# EAGLE design UPDIProgrammerStick_LW_Order (EAGLE 7.7.0)
COMPANY: ADAFRUIT INDUSTRIES; DRAWN: KTOWN; REV: H

## Sheet 1 of 2
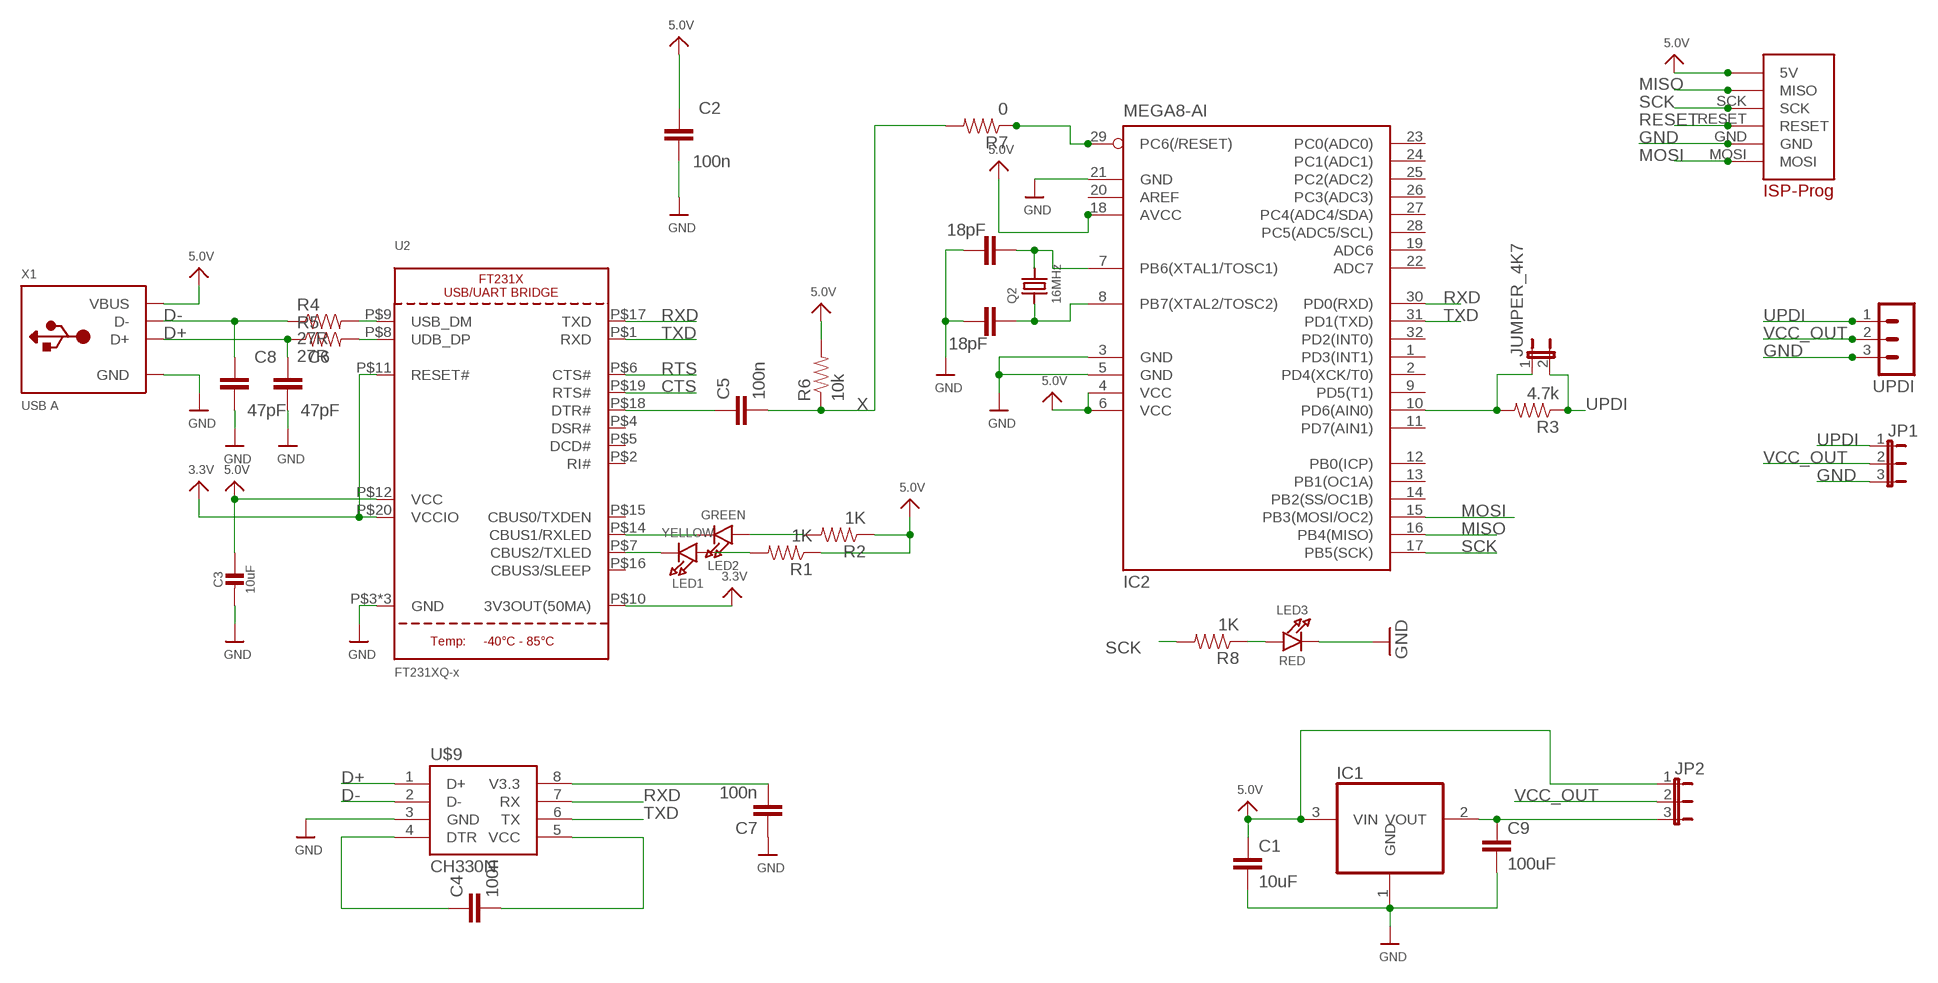
[diagram p0: schematic, sheet 1]

### Parts
C1  10uF  C-EUC1206  [C1206]
C2  100n  CAP0603-CAP  [0603-CAP]
C3  10uF  CAP_CERAMIC_1206  [_1206]
C4  100n  CAP0603-CAP  [0603-CAP]
C5  100n  CAP0603-CAP  [0603-CAP]
C6  47pF  CAP0603-CAP  [0603-CAP]
C7  100n  CAP0603-CAP  [0603-CAP]
C8  47pF  CAP0603-CAP  [0603-CAP]
C9  100uF  C-EUC1206  [C1206]
C12  18pF  CAP0603-CAP  [0603-CAP]
C13  18pF  CAP0603-CAP  [0603-CAP]
IC1  REG1117  [SOT223]
IC2  MEGA8-AI  [TQFP32-08]
JP1  JP2E  [JP2]
JP2  JP2E  [JP2]
JUMPER_4K7  JP1E  [JP1]
LED1  YELLOW  LED0805_NOOUTLINE  [CHIPLED_0805_NOOUTLINE]
LED2  GREEN  LED0805_NOOUTLINE  [CHIPLED_0805_NOOUTLINE]
LED3  RED  LED0805_NOOUTLINE  [CHIPLED_0805_NOOUTLINE]
Q2  16MHz  CRYSTALTHIN  [CRYSTAL_3.2X2.5]
R1  1K  0.3OHM-1/8W-1%(0805)  [0805]
R2  1K  0.3OHM-1/8W-1%(0805)  [0805]
R3  4.7k  0.3OHM-1/8W-1%(0805)  [0805]
R4  27R  0.3OHM-1/8W-1%(0805)  [0805]
R5  27R  0.3OHM-1/8W-1%(0805)  [0805]
R6  10k  0.3OHM-1/8W-1%(0805)  [0805]
R7  0  0.3OHM-1/8W-1%(0805)  [0805]
R8  1K  0.3OHM-1/8W-1%(0805)  [0805]
U2  FT231XQ-x  FT231X  [QFN20_4MM]
U$6  ISP_PROG_STECKERISP_PROG_REIHE_DIP  [ISP_PROG_REIHE_DIP]
U$9  CH330N  [SOIC8]
UPDI  S3B-PH-K-S  [S3B-PH-K-S]
X1  USB A  USB_TYPEA_CLIENTTHM  [USB_A-THM]

### Nets
3.3V: U2.P$10(3V3OUT(50MA)) U2.P$11(RESET#) U2.P$20(VCCIO)
5.0V: C1.1 C2.1 C3.1 IC1.3(VIN) IC2.4(VCC) IC2.6(VCC) IC2.18(AVCC) JP2.1 R1.1 R2.1 R6.2 U2.P$12(VCC) U$6.5V X1.VBUS
CTS: U2.P$19(RTS#)
D+: C6.1 R5.1 U$9.1(D+) X1.D+
D-: C8.1 R4.1 U$9.2(D-) X1.D-
GND: C1.2 C2.2 C3.2 C6.2 C7.1 C8.2 C9.2 C12.2 C13.2 IC1.1(GND) IC2.3(GND) IC2.5(GND) IC2.21(GND) JP1.3 LED3.C U2.P$3(GND) U2.P$13(GND) U2.P$21(GND) U$6.GND U$9.3(GND) UPDI.3 X1.GND
MISO: IC2.16(PB4(MISO)) U$6.MISO
MOSI: IC2.15(PB3(MOSI/OC2)) U$6.MOSI
N$1: LED2.A R2.2
N$2: C12.1 IC2.7(PB6(XTAL1/TOSC1)) Q2.2
N$3: IC2.10(PD6(AIN0)) JUMPER_4K7.1 R3.2
N$4: LED1.A R1.2
N$5: LED1.C U2.P$7(CBUS2/TXLED)
N$6: LED2.C U2.P$14(CBUS1/RXLED)
N$7: C7.2 U$9.8(V3.3)
N$11: C13.1 IC2.8(PB7(XTAL2/TOSC2)) Q2.1
N$12: C9.1 IC1.2(VOUT) JP2.3
N$13: C4.2 U$9.5(VCC)
N$15: R5.2 U2.P$8(UDB_DP)
N$16: LED3.A R8.1
N$20: C4.1 U$9.4(DTR)
N$24: R4.2 U2.P$9(USB_DM)
N$27: C5.1 U2.P$18(DTR#)
RESET: IC2.29(PC6(/RESET)) R7.1 U$6.RESET
RTS: U2.P$6(CTS#)
RXD: IC2.30(PD0(RXD)) U2.P$17(TXD) U$9.7(RX)
SCK: IC2.17(PB5(SCK)) R8.2 U$6.SCK
TXD: IC2.31(PD1(TXD)) U2.P$1(RXD) U$9.6(TX)
UPDI: JP1.1 JUMPER_4K7.2 R3.1 UPDI.1
VCC_OUT: JP1.2 JP2.2 UPDI.2
X: C5.2 R6.1 R7.2
Unconnected: IC2.1(PD3(INT1)) IC2.2(PD4(XCK/T0)) IC2.9(PD5(T1)) IC2.11(PD7(AIN1)) IC2.12(PB0(ICP)) IC2.13(PB1(OC1A)) IC2.14(PB2(SS/OC1B)) IC2.19(ADC6) IC2.20(AREF) IC2.22(ADC7) IC2.23(PC0(ADC0)) IC2.24(PC1(ADC1)) IC2.25(PC2(ADC2)) IC2.26(PC3(ADC3)) IC2.27(PC4(ADC4/SDA)) IC2.28(PC5(ADC5/SCL)) IC2.32(PD2(INT0)) U2.P$2(RI#) U2.P$4(DSR#) U2.P$5(DCD#) U2.P$15(CBUS0/TXDEN) U2.P$16(CBUS3/SLEEP)

## Sheet 2 of 2

## Library data of the parts
C1 C9 = rcl:C-EU: CAPACITOR, European symbol
C2 C4-C8 C12 C13 = SparkFun-Capacitors:CAP: Capacitor Standard 0603 ceramic capacitor, and 0.1" leaded capacitor.
C3 = microbuilder:CAP_CERAMIC: Ceramic Capacitors For new designs, use the packages preceded by an '_' character since they are more reliable: The following footprints should be used on most boards: _0402 - Standard footprint for regular board layouts _0603 - Standard footprint for regular board layouts _0805 - Standard footprint for regular board layouts _1206 - Standard footprint for regular board layouts For extremely tight-pitch boards where space is at a premium, the following 'micro-pitch' footprints can be used (smaller pads, no silkscreen outline, etc.): _0402MP - Micro-pitch footprint for very dense/compact boards _0603MP - Micro-pitch footprint for very dense/compact boards _0805MP - Micro-pitch footprint for very dense/compact boards _1206MP - Micro-pitch footprint for very dense/compact boards
IC1 = burr-brown:REG1117: 800mA and 1A Low Dropout (LDO) Positive Regulator 1.8V, 2.5V, 2.85V, 3.3V, 5V, and Adj; MPN: REG1117; OC_FARNELL: 1097566; OC_NEWARK: 14P6981
IC2 = atmel:MEGA8: MICROCONTROLLER 8 Kbytes FLASH, 1 kbytes SRAM, 512 bytes EEPROM, USART, 6-channel 10 bit ADC, 2-channel 8 bit ADC Pin compatible with Atmega48, ATMega88, ATMega168 Source: avr.lbr; MPN: ATMEGA8-16AU; OC_FARNELL: 9171371; OC_NEWARK: 73M8863
JP1 JP2 = jumper:JP2E: JUMPER
JUMPER_4K7 = jumper:JP1E: JUMPER
LED1-LED3 = microbuilder:LED: LED 0603 - 0603 Surface Mount Package 2mA: Green LED - Low Power (3.9mcd, 2ma, 1.7Vf) - Digikey: 475-2709-2-ND Orange LED - Low Power (9.8mcd, 2ma, 1.8Vf) - Digikey: 475-1194-2-ND Red LED - Low Power (5mcd, 2ma, 1.8Vf) - Digikey: 475-1195-2-ND Yellow LED - Low Power (7mcd, 2ma, 1.8Vf) - Digikey: 475-1196-2-ND 5mA: Blue LED - Low Power (17mcd, 5ma, 2.9Vf) - Digikey: LNJ937W8CRACT-ND 0805 - 0805 Surface Mount Package 2mA: Red LED (8.8mcd, 2mA, 1.8Vf, Clear) - Low Power [Digikey: 475-2510-1-ND] Green LED (5mcd, 2mA, 1.8Vf, Clear) - Low Power [Digikey: 475-2730-1-ND] Yellow LED (11.3mcd, 2mA, 1.8Vf, Clear) - Low Power [Digikey: 475-2555-1-ND] 20mA: Red LED (104mcd, 20mA, Diffused) - LS R976 [Digikey: 475-1278-6-ND] Red LED (12mcd, 20mA, 2.0Vf, Clear) - APT2012EC [Digikey: 754-1128-1-ND] Green LED (15mcd, 20mA, 2.2Vf, Clear) - APT2012GC [Digikey: 754-1131-1-ND] Orange LED (160mcd, 20mA, 2.1Vf, Clear) - APT2012SECK [Digikey: 754-1130-1-ND] 1206 - 1206 Surface Mount Package Green LED (26mcd, 20mA, Diffused) - LG N971 [Digikey: 475-1407-6-ND] Red LED (15mcd, 20mA, Diffused) - LH N974 [Digikey: 475-1416-6-ND] Cree - Cree High-Power Surface Mount LEDs XPEBWT-L1-0000-00D50 - White 111lm 350mA 2.9Vf 6200K 110° XTEAWT-00-0000-00000LEE3 - White 114lm 350mA 2.85Vf 5000K 115° Everlight - Everlight 45-21 Series Surface Mount LEDs 45-21/QK2C-B2832AC2CB2/2T - Warm White 2000mcd 20mA 3.25Vf 3050K 120° 45-21/LK2C-B38452C4CB2/2T - Nuetral White 2000mcd 20mA 3.25Vf 4150K 120° 45-21/LK2C-B50634C6CB2/2T - Cold White 2200mcd 20mA 3.25Vf 5650K 120° PLCC2 Reverse Mount LS T77K-J1L2-1-0-2-R18-Z - Red 11.25mcd 2mA 1.8Vf 630nm 120° LO T77K-L1M2-24-Z - Orange 19.6mcd 2mA 1.8Vf 606nm 120° LY T77K-K2M1-26-Z - Yellow 15.7mcd 2mA 1.8Vf 587nm 120°
Q2 = microbuilder:CRYSTAL: Crystals HC49UP - Surface Mount Crystal 4.0MHz 18pF +/-30ppm Surface Mount Crystal [Digikey: 535-9857-1-ND] 12.0 MHz Surface Mount Crystal [Digikey: 535-9869-6-ND] 25.0 MHz Surface Mount Crystal [Digikey: 535-9078-1-ND] 2.5 x 2.0mm - MEMs SMT Crystal 16.0 MHz 10pF 20ppm 2.5 x 2.0mm Crystal [Digikey -40-85°C: 535-10923-1-ND] 3.2 x 2.5mm - MEMs SMT Crystal 12.0 MHz 8pF 15ppm 3.2 x 2.5mm Crystal [Digikey: -10-70°C: 644-1047-1-ND -40-125°C: 644-1128-1-ND] 16.0 MHz 8pF 15ppm 3.2 x 2.5mm Crystal [Digikey: -10-70°C: 644-1049-1-ND -40-125°C: 644-1129-2-ND] 16.0 MHz 10pF 10ppm 3.2 x 2.5mm Crystal [Digikey: 644-1100-1-ND] 27.12 MHz 18pF 30ppm 3.2 x 2.5mm Crystal [Digikey: 887-1424-1-ND] 27.12MHz 10pF 10ppm 3.2 x 2.5mm Crystal [Digikey: 887-1329-1-ND] 4.9 x 1.8mm - MEMs SMT Crystal 32.768 KHz 12.5pF 20ppm 4.9 x 1.8mm Crystal [Digikey: SE2415CT-ND] 8.0 x 3.8mm - Surface Mount Crystal 32.768kHz 12.5pF 20ppm -40°C-85°C [Digikey: 535-9166-2-ND] Cylinder 32.768KHz Cylinder Crystal (2x6mm body) [Ex. Digikey: 300-8341-2-ND]
R1-R8 = SparkFun-Resistors:0.3OHM-1/8W-1%(0805): RES-11622; PROD_ID: RES-11622; VALUE: 0.3
U2 = microbuilder:FT231X: FT231X USB To Full Handshake UART IC
U$6 = RUAG_el_LW:ISP_PROG_STECKER
U$9 = ch330n:CH330N
UPDI = con-JST:S3B-PH: JST PH series header 2.00mm pitch disconnectable crimp style connectors, horizontal (side entry type), 3 pins
X1 = microbuilder:USB_TYPEA: USB - Type A Connectors Male types stick out and are inserted into a PC or matching females parts (these are the connectors used on USB Memory Sticks, etc.). Female parts are generally used for USB Host and accept a male-type connector. SMT - 4UCON: 10017 PTHFML - Digikey: 609-1045-ND, 4UCon: 05241 PCB - Use 2.0mm thick PCBs with this footprint

## Board
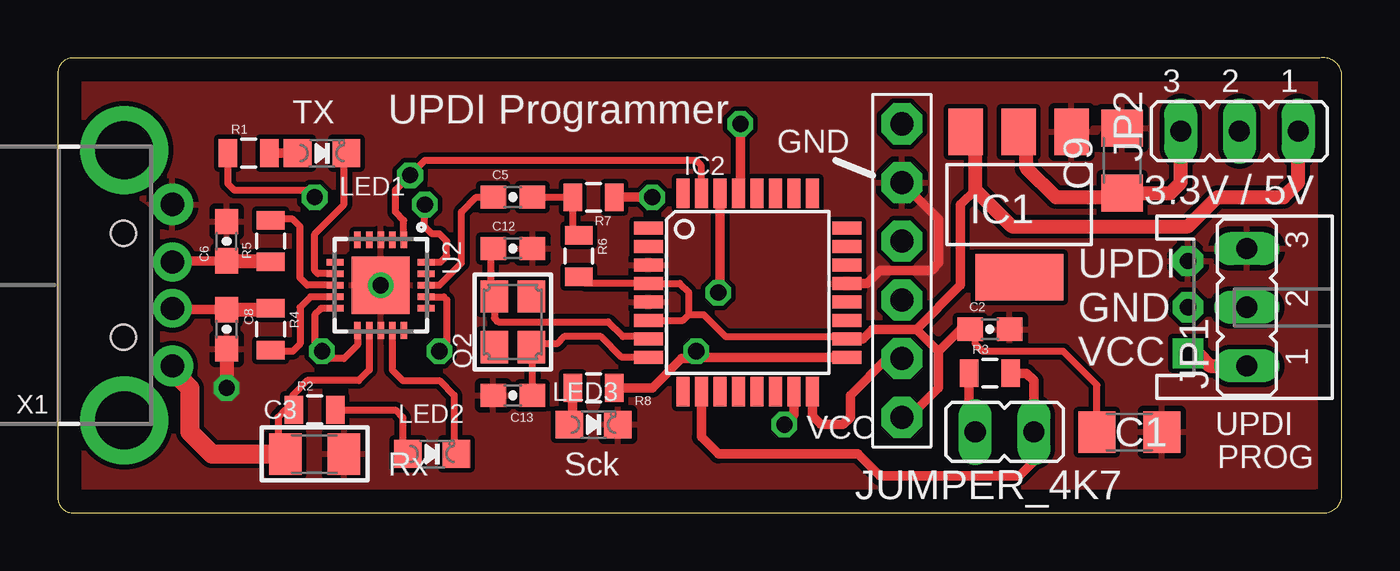
[diagram p1: board, top side]
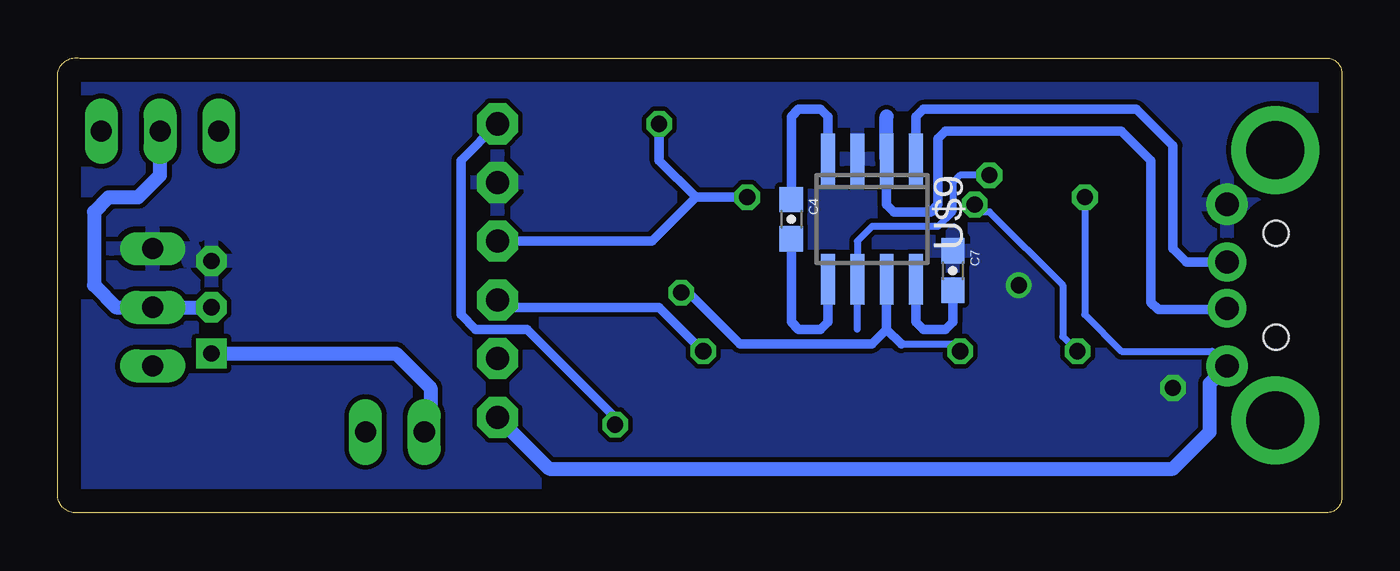
[diagram p2: board, bottom side, seen from below]

Size 55.54 x 19.7 mm. Coordinates in mm from the lower left corner, seen from the top.
Outline: 0,19.05 0,0.65 arc90 0.63,0.02 54.59,0.02 arc90 55.54,0.65 55.54,19.05 arc90 54.59,19.69 0.63,19.69 arc90 0,19.05
Copper layers (1*16): Top 0.035mm / dielectric 1.5mm / Bottom 0.035mm
Design rules "default": minimum track width 10mil, minimum drill 24mil, track to track 8mil, track to pad 8mil, pad to pad 8mil, via to via 8mil, smd to smd 8mil, copper to edge 40mil, drill to drill 8mil, minimum pad ring 10mil, minimum via ring 8mil, stop-mask expansion 4mil, vias tented up to drill 0mil, thermal gap 10mil

### Footprints (pad centres in the part's own frame; a part is rotated, then mirrored left to right if it is on the bottom)
C1206 = smd 1.6 x 1.8: 1 -1.4,0; 2 1.4,0
0603-CAP = smd 1.1 x 1: 1 -0.85,0; 2 0.85,0
_1206 = smd 1.4 x 1.8: 1 -1.27,0; 2 1.27,0
SOT223 = smd 1.499 x 2.007: 1 -2.261,-3.15; 2 0.025,-3.15; 3 2.311,-3.15 | smd 3.81 x 2.007: 4 0,3.15
TQFP32-08 = smd 1.27 x 0.559: 1 -4.293,2.8; 2 -4.293,2; 3 -4.293,1.2; 4 -4.293,0.4; 5 -4.293,-0.4; 6 -4.293,-1.2; 7 -4.293,-2; 8 -4.293,-2.8; 17 4.293,-2.8; 18 4.293,-2; 19 4.293,-1.2; 20 4.293,-0.4; 21 4.293,0.4; 22 4.293,1.2; 23 4.293,2; 24 4.293,2.8 | smd 0.559 x 1.27: 9 -2.8,-4.293; 10 -2,-4.293; 11 -1.2,-4.293; 12 -0.4,-4.293; 13 0.4,-4.293; 14 1.2,-4.293; 15 2,-4.293; 16 2.8,-4.293; 25 2.8,4.293; 26 2,4.293; 27 1.2,4.293; 28 0.4,4.293; 29 -0.4,4.293; 30 -1.2,4.293; 31 -2,4.293; 32 -2.8,4.293
JP2 = drill 0.914 long: 1 -2.54,0; 2 0,0; 3 2.54,0
JP1 = drill 0.914 long: 1 0,-1.27; 2 0,1.27
CHIPLED_0805_NOOUTLINE = smd 1.2 x 1.2: A 0,-1.05; C 0,1.05
CRYSTAL_3.2X2.5 = smd 1.4 x 1.2: 1 -1.1,-0.8; 2 1.1,0.8; GND1 -1.1,0.8; GND2 1.1,-0.8
0805 = smd 0.8 x 1.2: 1 -0.9,0; 2 0.9,0
QFN20_4MM = smd 0.73 x 0.28: P$1 -1.965,1; P$2 -1.965,0.5; P$3 -1.965,0; P$4 -1.965,-0.5; P$5 -1.965,-1; P$11 1.965,-1; P$12 1.965,-0.5; P$13 1.965,0; P$14 1.965,0.5; P$15 1.965,1 | smd 0.28 x 0.73: P$6 -1,-1.965; P$7 -0.5,-1.965; P$8 0,-1.965; P$9 0.5,-1.965; P$10 1,-1.965; P$16 1,1.965; P$17 0.5,1.965; P$18 0,1.965; P$19 -0.5,1.965; P$20 -1,1.965 | smd 2.5 x 2.5: P$21 0,0
ISP_PROG_REIHE_DIP = drill 1 pad 1.778 octagon: 5V 5.08,0; GND -5.08,0; MISO 2.54,0; MOSI -7.62,0; RESET -2.54,0; SCK 0,0
SOIC8 = smd 0.6 x 2.2: 1 -1.905,-2.6; 2 -0.635,-2.6; 3 0.635,-2.6; 4 1.905,-2.6; 5 1.905,2.6; 6 0.635,2.6; 7 -0.635,2.6; 8 -1.905,2.6
S3B-PH-K-S = drill 0.7 pad 1.3 square: 1 2,0 | drill 0.7 pad 1.3 octagon: 2 0,0; 3 -2,0
USB_A-THM = drill 1 pad 1.676: D+ 1,-2.1; D- -1,-2.1 | drill 1 pad 1.778: GND 3.5,-2.1; VBUS -3.5,-2.1 | drill 2.5 pad 3.81: MNT1 -5.85,-0.02; MNT2 5.85,-0.02 | hole 1.1: -2.25,0.022; 2.25,0.022

### Placement (x,y rotation side)
C1  46.36,3.51 0 top
C2  40.32,7.95 0 top
C3  11.11,2.56 0 top
C4  23.81,12.72 270 bottom
C5  19.68,13.67 0 top
C6  7.3,11.76 90 top
C7  16.83,10.49 270 bottom
C8  7.3,7.95 270 top
C9  46.04,15.26 90 top
C12  19.68,11.45 0 top
C13  19.68,5.1 180 top
IC1  41.59,13.35 180 top
IC2  29.85,9.54 0 top
JP1  51.44,8.91 90 top
JP2  51.12,16.53 180 top
JUMPER_4K7  40.96,3.51 90 top
LED1  11.43,15.57 270 top
LED2  16.19,2.56 270 top
LED3  23.18,3.83 270 top
Q2  19.68,8.27 90 top
R1  8.25,15.57 0 top
R2  11.11,4.46 0 top
R3  40.32,6.05 0 top
R4  9.21,7.95 270 top
R5  9.21,11.76 90 top
R6  22.54,11.13 270 top
R7  23.18,13.67 180 top
R8  23.18,5.41 0 top
U2  13.97,9.86 270 top
U$6  36.51,9.22 270 top
U$9  20.32,12.72 180 bottom
UPDI  48.89,8.91 270 top
X1  2.86,9.86 90 top

### Tracks (layer width: path | path; a pad name or v marks a point on that pad's centre or on a via)
3.3V  (via drill 0.7)
  Top 0.305: U2.P$10 11.38,8.86 11.11,8.59 11.11,7.32 v11.43,7 11.75,6.68 12.38,6.68 12.97,7.27 U2.P$11 | U2.P$20 16.56,10.86 16.83,11.13 16.83,11.76 16.51,12.08 16.19,12.08 15.88,12.4 v15.88,13.35
  Bottom 0.305: v11.43,7 12.06,7.64 12.06,9.86 15.24,13.03 15.56,13.03 v15.88,13.35
5.0V  (via drill 0.7)
  Top 0.305: R6.2 22.83,9.94 IC2.4 26.91,9.94 27.3,9.54 27.3,8.59 | IC2.6 27.06,8.34 27.3,8.59 | 27.3,8.59 27.94,8.59 28.89,7.64 34.04,7.64 IC2.18 | C1.1 44.96,5.54 43.5,7 40,7 39.69,7.32 39.69,7.74 | R1.1 7.36,14.25 7.62,13.99 10.8,13.99 v11.11,13.67 | U2.P$12 13.47,6.18 13.02,5.73 10.8,5.73 10.16,5.1 10.16,4.51 R2.1 9.84,4.46 9.53,4.14 9.53,2.87 C3.1
  Top 0.406: IC2.18 34.83,7.54 35.24,7.95 37.15,7.95 | 37.15,7.95 39.05,9.86 39.05,13.35 39.69,13.99 | U$6.5V 36.83,4.14 38.1,5.41 38.1,7 | 38.1,7 37.15,7.95 | 38.1,7 39.05,7.95 C2.1 39.69,7.74
  Top 0.61: IC1.3 39.69,16.41 39.69,13.99 41.28,12.4 48.89,12.4 50.17,13.67 53.02,13.67 53.66,14.3 JP2.1
  Top 0.813: X1.VBUS 4.96,6.17 5.72,5.41 5.72,3.51 6.67,2.56 C3.1
  Bottom 0.305: v11.11,13.67 11.11,8.59 9.53,7 5.6,7 X1.VBUS
  Bottom 0.61: U$6.5V 34.29,1.92 7.3,1.92 5.72,3.51 5.72,5.6 X1.VBUS 5.39,6.36
D+
  Top 0.406: C6.1 5.01,10.91 X1.D+
  Top 0.61: 7.25,10.86 C6.1 9.16,10.91 R5.1
  Bottom 0.406: X1.D+ 6.72,10.86 7.3,11.45 7.3,15.89 8.89,17.48 18.1,17.48 18.41,17.16 U$9.1
D-
  Top 0.406: C8.1 5.01,8.8 X1.D-
  Top 0.61: 7.25,8.86 C8.1 9.16,8.8 R4.1
  Bottom 0.406: U$9.2 19.68,13.35 19.37,13.03 17.78,13.03 17.46,13.35 17.46,16.21 17.14,16.53 9.53,16.53 8.25,15.26 8.25,9.12 7.94,8.8 5.01,8.8 X1.D- 5.01,8.91
  Bottom 0.61: U$9.2 19.68,17.16
GND  (via drill 0.7)
  Top 0.406: IC2.21 35.01,9.94 35.56,10.49 37.78,10.49 38.1,10.81 38.1,12.72 U$6.GND | C6.2 7.3,12.4
  Top 0.61: C8.2 v7.3,5.41
  other vias: 13.97,9.86
  pour Top: 0,0.02 55.56,0.02 55.56,19.7 0,19.7
  pour Bottom: 0,19.7 0,0.02 55.56,-0.3 55.56,19.7
MISO
  Top 0.406: IC2.16 32.64,4.2 33.02,3.83 33.97,3.83 34.29,4.14 34.29,5.1 35.88,6.68 U$6.MISO
MOSI  (via drill 0.7)
  Top 0.406: IC2.15 31.85,4.24 v31.43,3.83
  Bottom 0.406: v31.43,3.83 31.43,4.14 35.24,7.95 37.47,7.95 38.1,8.59 38.1,15.26 U$6.MOSI
N$1
  Top 0.305: R2.2 14.61,4.46 14.92,4.14 14.92,2.78 LED2.A
N$2
  Top 0.305: C12.1 19.2,11.4 19,11.4 18.73,11.13 18.73,9.52 Q2.2 18.89,8.44 19.05,8.27 23.81,8.27 24.45,7.64 25.46,7.64 IC2.7
N$3
  Top 0.406: IC2.10 27.84,3.29 28.57,2.56 34.61,2.56 35.56,1.6 41.59,1.6 42.23,2.24 JUMPER_4K7.1 42.23,5.73 41.91,6.05 R3.2
N$4
  Top 0.406: R1.2 LED1.A
N$5
  Top 0.305: U2.P$7 11.25,10.36 11.11,10.49 11.11,12.08 12.38,13.35 12.38,15.48 LED1.C
N$6
  Top 0.305: U2.P$14 14.47,6.18 14.92,5.73 16.51,5.73 17.14,5.1 17.14,2.65 LED2.C
N$7
  Bottom 0.406: C7.2 16.83,8.27 17.14,7.95 18.1,7.95 18.41,8.27 U$9.8
N$11
  Top 0.305: C13.1 20.54,7.12 Q2.1 20.63,7.32 21.59,7.32 21.91,7.64 23.5,7.64 24.39,6.74 IC2.8
N$12
  Top 0.61: IC1.2 41.91,16.48 41.91,14.94 43.18,13.67 45.85,13.67 C9.1 48.13,13.86 48.58,14.3 JP2.3
N$13
  Bottom 0.406: U$9.5 22.23,8.27 22.54,7.95 23.5,7.95 23.81,8.27 C4.2
N$15
  Top 0.305: 9.21,12.72 R5.2 9.26,12.72 10.16,12.72 10.48,12.4 10.48,10.18 10.8,9.86 U2.P$8
N$16
  Top 0.406: R8.1 22.28,3.98 LED3.A
N$20
  Bottom 0.406: U$9.4 22.23,17.16 22.54,17.48 23.5,17.48 23.81,17.16 C4.1
N$24
  Top 0.305: R4.2 9.26,7 10.16,7 10.48,7.32 10.48,8.91 10.93,9.36 U2.P$9
N$27
  Top 0.305: C5.1 18.1,13.67 17.46,13.03 17.46,10.81 16.51,9.86 U2.P$18
RESET  (via drill 0.7)
  Top 0.406: R7.1 v25.72,13.67 | IC2.29 29.53,13.92 v29.53,16.84
  Bottom 0.406: v25.72,13.67 27.94,13.67 | 27.94,13.67 29.53,15.26 v29.53,16.84 | U$6.RESET 29.85,11.76 27.94,13.67
RXD  (via drill 0.7)
  Top 0.305: U2.P$17 16.69,9.36 16.83,9.22 16.83,7.32 v16.51,7
  Top 0.406: IC2.30 28.64,9.61 v28.57,9.54
  Bottom 0.305: 19.05,7.32 16.83,7.32 v16.51,7
  Bottom 0.406: 19.68,8.27 U$9.7 19.68,7.95 | 19.68,7.95 19.05,7.32 | v28.57,9.54 28.26,9.54 26.04,7.32 20.32,7.32 19.68,7.95
SCK  (via drill 0.7)
  Top 0.406: 34.08,6.68 IC2.17 27.88,6.74 v27.62,7 27.3,6.68 26.99,6.68 25.72,5.41 R8.2
  Bottom 0.406: U$6.SCK 36.19,8.91 29.53,8.91 v27.62,7
TXD  (via drill 0.7)
  Top 0.305: U2.P$1 14.97,12.67 14.61,13.03 14.61,13.99 v15.24,14.62 15.88,15.26 27.62,15.26 27.84,15.03 IC2.31
  Bottom 0.305: v15.24,14.62 16.51,14.62 16.83,14.3 16.83,13.03 17.46,12.4 20.32,12.4 20.95,11.76 U$9.6 20.95,7.95
UPDI
  Top 0.406: R3.1 39.42,3.77 JUMPER_4K7.2
  Top 0.61: JP1.1 49.85,6.37 49.31,6.91 UPDI.1
  Bottom 0.61: UPDI.1 40.92,6.91 39.42,5.41 39.42,3.77 JUMPER_4K7.2
VCC_OUT
  Bottom 0.61: UPDI.2 JP1.2 53.02,8.91 53.97,9.86 53.97,13.03 53.34,13.67 52.07,13.67 51.12,14.62 JP2.2
X
  Top 0.305: C5.2 R7.2 22.28,12.29 R6.1

### Text on the board
tPlace: TX | UPDI Programmer | GND | 3.3V / 5V | UPDI | GND | VCC | VCC | Rx | Sck | PROG